# EAGLE design Lightbulb (EAGLE 9.2.0)
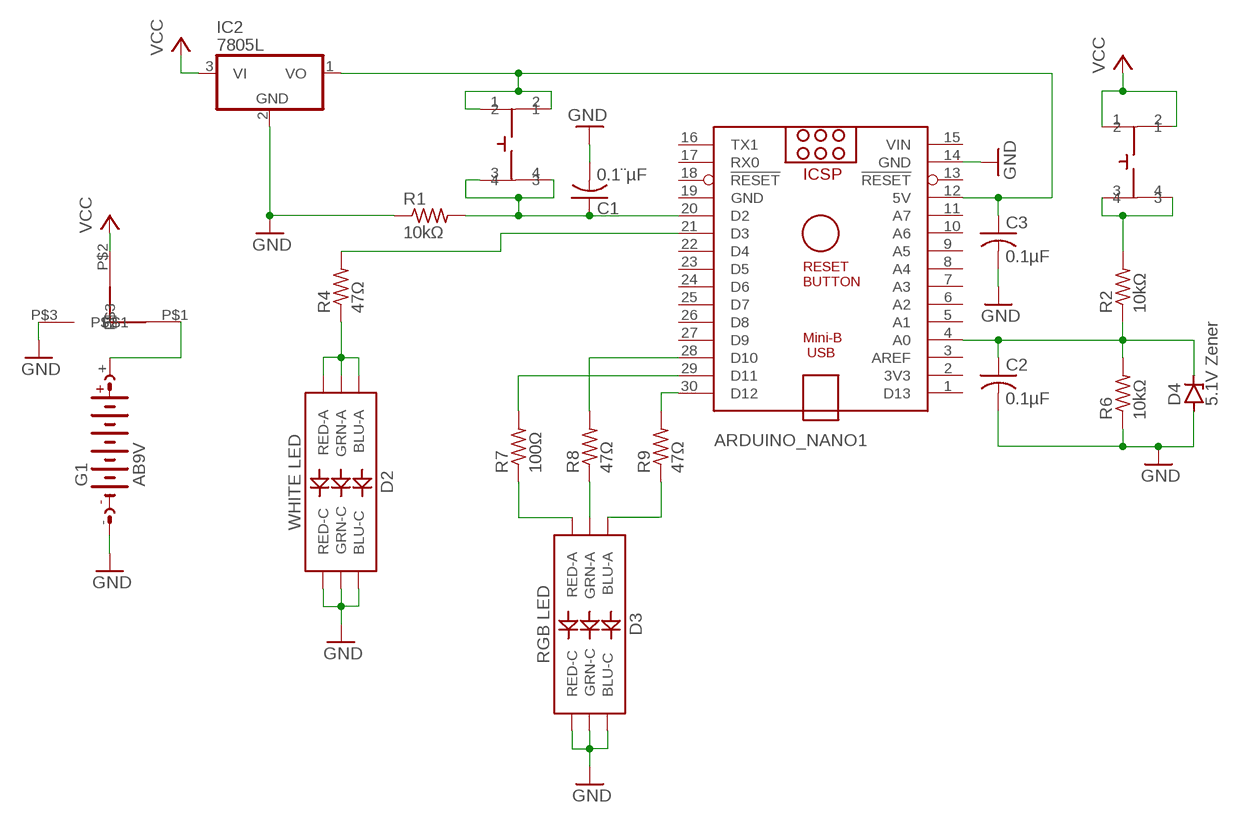
[diagram p0: schematic, sheet 1]

## Parts
ARDUINO_NANO1  ARDUINO_NANO  [ARDUINO_NANO]
C1  0.1¨µF  C-USC0805  [C0805]
C2  0.1µF  C-USC0805  [C0805]
C3  0.1µF  C-USC0805  [C0805]
D2  WHITE LED  LED-RGBNO_IC  [LED-TRICOLOR-5050]
D3  RGB LED  LED-RGBNO_IC  [LED-TRICOLOR-5050]
D4  5.1V Zener  ZENER-DIODESOD64-12  [SOD64Z12]
G1  AB9V  [AB9V]
IC2  7805L  [TO92]
R1  10kΩ  R-US_R0805  [R0805]
R2  10kΩ  R-US_R0805  [R0805]
R4  47Ω  R-US_R0805  [R0805]
R6  10kΩ  R-US_R0805  [R0805]
R7  100Ω  R-US_R0805  [R0805]
R8  47Ω  R-US_R0805  [R0805]
R9  47Ω  R-US_R0805  [R0805]
U$1  SKRPABE010  [SKRPABE010]
U$2  SKRPABE010  [SKRPABE010]
U$3  DIPSWITCH  [DIPSWITCH]

## Nets
GND: ARDUINO_NANO1.14(GND) C1.2 C2.2 C3.2 D2.4(BLU-C) D2.5(RED-C) D2.6(GRN-C) D3.4(BLU-C) D3.5(RED-C) D3.6(GRN-C) D4.A G1.- IC2.2(GND) R1.1 R6.1 U$3.P$3
N$1: G1.+ U$3.P$1
N$2: ARDUINO_NANO1.30(D12) R9.2
N$3: ARDUINO_NANO1.20(D2) C1.1 R1.2 U$1.3 U$1.4
N$4: ARDUINO_NANO1.12(5V) C3.1 IC2.1(VO) U$1.1 U$1.2
N$5: ARDUINO_NANO1.4(A0) C2.1 D4.C R2.1 R6.2
N$6: R2.2 U$2.3 U$2.4
N$7: ARDUINO_NANO1.21(D3) R4.2
N$8: ARDUINO_NANO1.29(D11) R7.2
N$9: D3.2(RED-A) R7.1
N$10: D3.1(GRN-A) R8.1
N$11: D3.3(BLU-A) R9.1
N$12: ARDUINO_NANO1.28(D10) R8.2
N$18: D2.1(GRN-A) D2.2(RED-A) D2.3(BLU-A) R4.1
VCC: IC2.3(VI) U$2.1 U$2.2 U$3.P$2
Unconnected: ARDUINO_NANO1.1(D13) ARDUINO_NANO1.2(3V3) ARDUINO_NANO1.3(AREF) ARDUINO_NANO1.5(A1) ARDUINO_NANO1.6(A2) ARDUINO_NANO1.7(A3) ARDUINO_NANO1.8(A4) ARDUINO_NANO1.9(A5) ARDUINO_NANO1.10(A6) ARDUINO_NANO1.11(A7) ARDUINO_NANO1.13(!RESET) ARDUINO_NANO1.16(TX1) ARDUINO_NANO1.17(RX0) ARDUINO_NANO1.18(!RESET) ARDUINO_NANO1.22(D4) ARDUINO_NANO1.23(D5) ARDUINO_NANO1.24(D6) ARDUINO_NANO1.25(D7) ARDUINO_NANO1.26(D8) ARDUINO_NANO1.27(D9)

## Power pins joined to a net without a drawn wire
GND: ARDUINO_NANO1.19(GND)
VIN: ARDUINO_NANO1.15(VIN)

## Library data of the parts
ARDUINO_NANO1 = ArduinoNanoV30:ARDUINO_NANO: Arduino Nano V3.0 Overview: The Arduino Nano is a small, complete, and breadboard-friendly board based on the ATmega328 (Arduino Nano 3.x) or ATmega168 (Arduino Nano 2.x). It has more or less the same functionality of the Arduino Duemilanove, but in a different package. It lacks only a DC power jack, and works with a Mini-B USB cable instead of a standard one. The Nano was designed and is being produced by Gravitech. Specifications: Microcontroller Atmel ATmega168 or ATmega328 Operating Voltage (logic level) 5 V Input Voltage (recommended) 7-12 V Input Voltage (limits) 6-20 V Digital I/O Pins 14 (of which 6 provide PWM output) Analog Input Pins 8 DC Current per I/O Pin 40 mA Flash Memory 16 KB (ATmega168) or 32 KB (ATmega328) of which 2 KB used by bootloader SRAM 1 KB (ATmega168) or 2 KB (ATmega328) EEPROM 512 bytes (ATmega168) or 1 KB (ATmega328) Clock Speed 16 MHz Dimensions 0.73" x 1.70" Length 45 mm Width 18 mm Weigth 5 g Power: The Arduino Nano can be powered via the Mini-B USB connection, 6-20V unregulated external power supply (pin 30), or 5V regulated external power supply (pin 27). The power source is automatically selected to the highest voltage source. Memory: The ATmega168 has 16 KB of flash memory for storing code (of which 2 KB is used for the bootloader); the ATmega328 has 32 KB, (also with 2 KB used for the bootloader). The ATmega168 has 1 KB of SRAM and 512 bytes of EEPROM (which can be read and written with the EEPROM library); the ATmega328 has 2 KB of SRAM and 1 KB of EEPROM. Input and Output: Each of the 14 digital pins on the Nano can be used as an input or output, using pinMode(), digitalWrite(), and digitalRead() functions. They operate at 5 volts. Each pin can provide or receive a maximum of 40 mA and has an internal pull-up resistor (disconnected by default) of 20-50 kOhms. In addition, some pins have specialized functions. Visit Arduino - ArduinoBoardNano <https://www.arduino.cc/en/Main/ArduinoBoardNano>
C1-C3 = adafruit:C-US: CAPACITOR, American symbol
D2 D3 = SparkFun-LED:LED-RGB: LED-RGB 6 pin RGB LED (no common connector) Packages: PLCC-6 LED-TRICOLOR-5050 - No built-in IC SparkFun Products: Digital Sandbox <https://www.sparkfun.com/products/12651> LED- SMD RGB <https://www.sparkfun.com/products/10866>; PROD_ID: DIO-10298
D4 = diode:ZENER-DIODE: Z-Diode
G1 = battery:AB9V: 9-V BATTERY CLIP
IC2 = adafruit:78*: Positive VOLTAGE REGULATOR Added bigger pads to the TO-92 package
R1 R2 R4 R6-R9 = adafruit:R-US_: RESISTOR, American symbol
U$1 U$2 = Custom Library:SKRPABE010
U$3 = Custom Library:DIPSWITCH

## Net classes
0 default: width 0.508 mm, drill 0.508 mm, clearance 0.305 mm

## Board
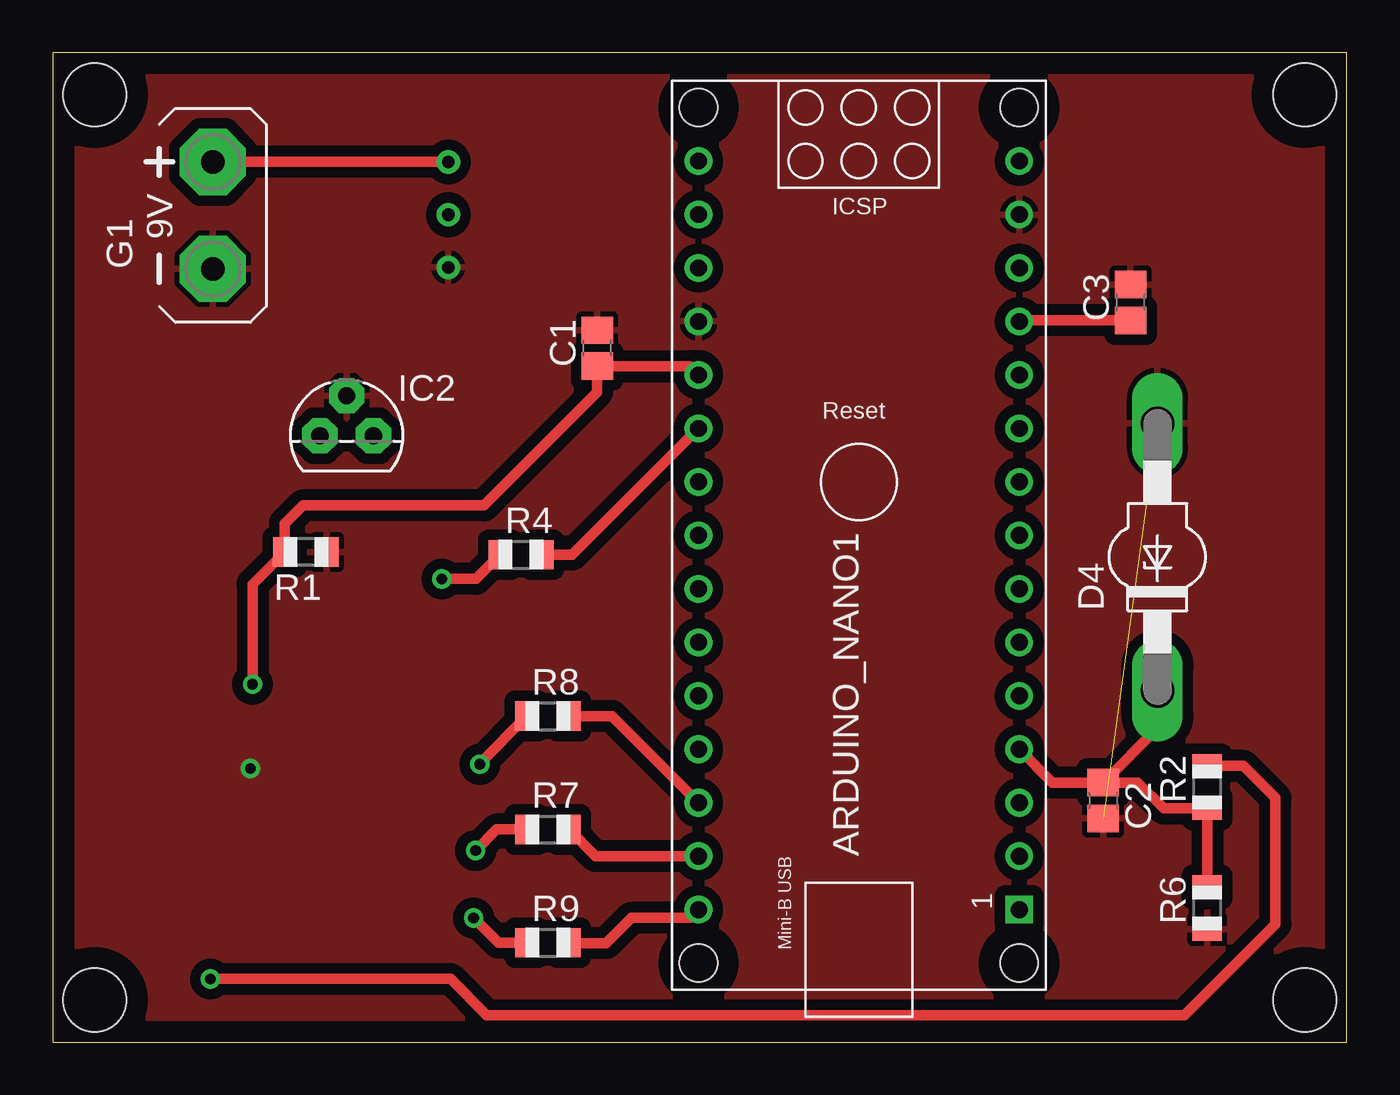
[diagram p1: board, top side]
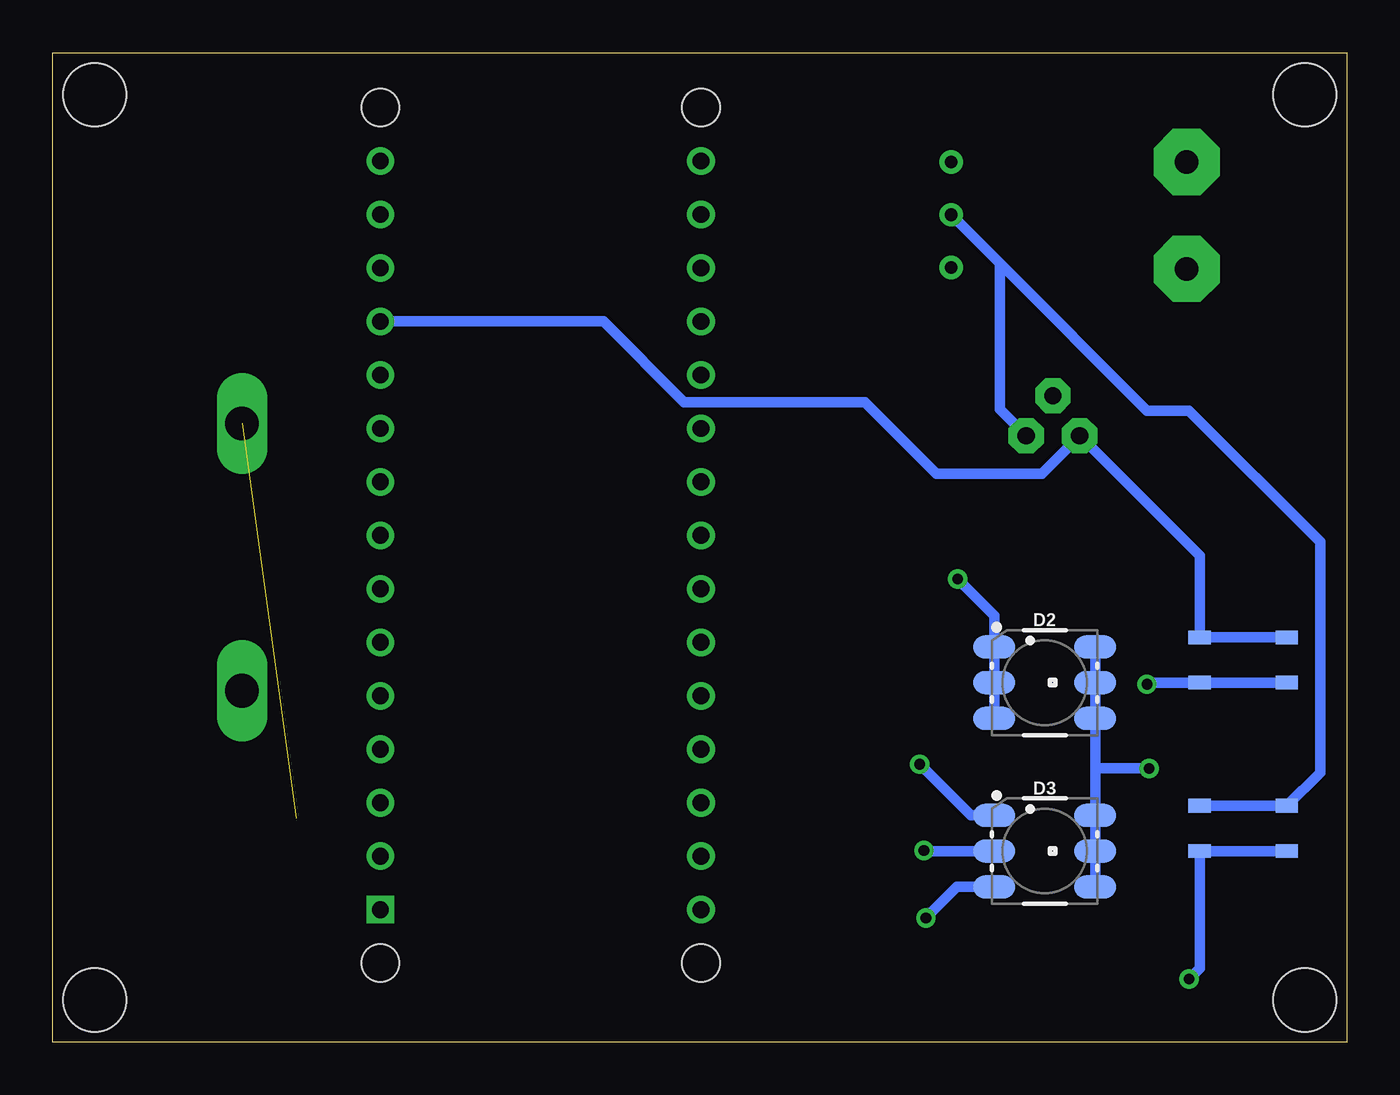
[diagram p2: board, bottom side, seen from below]

Size 61.5 x 47 mm. Coordinates in mm from the lower left corner, seen from the top.
Outline: 0,0 61.5,0 61.5,47 0,47 0,0
Copper layers (1*16): Top 0.035mm / dielectric 1.5mm / Bottom 0.035mm
Design rules "default *": minimum track width 6mil, minimum drill 0.35mm, track to track 20mil, track to pad 20mil, pad to pad 20mil, via to via 20mil, smd to smd 20mil, copper to edge 40mil, drill to drill 6mil, minimum pad ring 10mil, minimum via ring 8mil, stop-mask expansion 4mil, vias tented up to drill 0mil, thermal gap 10mil
Holes 3 mm at 2,45 2,2 59.5,2 59.5,45

### Footprints (pad centres in the part's own frame; a part is rotated, then mirrored left to right if it is on the bottom)
ARDUINO_NANO = drill 0.8 square: 1 -20.32,-7.62 | drill 0.8: 2 -17.78,-7.62; 3 -15.24,-7.62; 4 -12.7,-7.62; 5 -10.16,-7.62; 6 -7.62,-7.62; 7 -5.08,-7.62; 8 -2.54,-7.62; 9 0,-7.62; 10 2.54,-7.62; 11 5.08,-7.62; 12 7.62,-7.62; 13 10.16,-7.62; 14 12.7,-7.62; 15 15.24,-7.62; 16 15.24,7.62; 17 12.7,7.62; 18 10.16,7.62; 19 7.62,7.62; 20 5.08,7.62; 21 2.54,7.62; 22 0,7.62; 23 -2.54,7.62; 24 -5.08,7.62; 25 -7.62,7.62; 26 -10.16,7.62; 27 -12.7,7.62; 28 -15.24,7.62; 29 -17.78,7.62; 30 -20.32,7.62 | hole 1.778: -22.86,-7.62; -22.86,7.62; 17.78,7.62; 17.78,-7.62
C0805 = smd 1.3 x 1.5: 1 -0.85,0; 2 0.85,0
LED-TRICOLOR-5050 = smd 2 x 1.1: 1 -2.4,1.7; 2 -2.4,0; 3 -2.4,-1.7; 4 2.4,-1.7; 5 2.4,0; 6 2.4,1.7
SOD64Z12 = drill 1.6 long: A 6.35,0; C -6.35,0
AB9V = drill 1.118 pad 3.15 octagon: + 0,2.54; - 0,-2.54
TO92 = drill 0.813 pad 1.676 octagon: 1 -1.27,0; 2 0,1.905; 3 1.27,0
R0805 = smd 1.1 x 1.4: 1 -1,0; 2 1,0
SKRPABE010 = smd 1.05 x 0.65: 1 0,2.15; 2 4.15,2.15; 3 0,0; 4 4.15,0
DIPSWITCH = drill 0.6: P$1 0,0; P$2 0,2.5; P$3 0,5

### Placement (x,y rotation side)
ARDUINO_NANO1  38.31,26.61 90 top
C1  25.88,32.96 90 top
C2  49.92,11.48 270 top
C3  51.22,35.13 90 top
D2  14.36,17.07 0 bottom
D3  14.36,9.07 0 bottom
D4  52.5,23.04 90 top
G1  7.61,39.27 0 top
IC2  13.97,28.8 0 top
R1  12.03,23.28 180 top
R2  54.87,12.12 90 top
R4  22.26,23.15 0 top
R6  54.87,6.37 90 top
R7  23.53,10.1 0 top
R8  23.53,15.48 0 top
R9  23.53,4.72 0 top
U$1  7,17.07 0 bottom
U$2  7,9.07 0 bottom
U$3  18.8,41.8 180 top

### Tracks (layer width: path | path; a pad name or v marks a point on that pad's centre or on a via)
GND  (via drill 0.51)  (1 unrouted)
  Bottom 0.508: D2.6 D2.5 D2.4 11.96,13 | D3.4 D3.5 D3.6 11.96,13 | 11.96,13 v9.4,13
  pour Top: -0.5,48 -0.5,-1 68.5,-1 68.5,48
N$1
  Top 0.508: G1.+ U$3.P$1
N$2
  Top 0.508: ARDUINO_NANO1.30 30.31,5.91 29.8,5.91 29.79,5.9 27.5,5.9 26.3,4.7 24.55,4.7 R9.2
N$3  (via drill 0.51)
  Top 0.508: v9.5,17 9.5,21.75 R1.2 11.03,24.63 11.9,25.5 20.5,25.5 25.88,30.88 C1.1 30.27,32.11 ARDUINO_NANO1.20
  Bottom 0.508: U$1.4 U$1.3 9.43,17.07 v9.5,17
N$4
  Top 0.508: C3.1 45.98,34.28 ARDUINO_NANO1.12
  Bottom 0.508: ARDUINO_NANO1.12 35.33,34.23 31.5,30.4 22.9,30.4 19.5,27 14.5,27 IC2.1 7,23.1 U$1.1 U$1.2
N$5
  Top 0.508: R6.2 R2.1 54.84,11.1 52.8,11.1 51.57,12.33 C2.1 | D4.C 52.5,14.91 C2.1 | C2.1 47.51,12.33 ARDUINO_NANO1.4
N$6  (via drill 0.51)
  Top 0.508: v7.5,3 18.9,3 20.63,1.27 53.77,1.27 58.1,5.6 58.1,11.6 56.58,13.12 R2.2
  Bottom 0.508: U$2.4 U$2.3 7,3.5 v7.5,3
N$7
  Top 0.508: ARDUINO_NANO1.21 24.69,23.15 R4.2
N$8
  Top 0.508: ARDUINO_NANO1.29 25.8,8.83 R7.2
N$9  (via drill 0.51)
  Top 0.508: R7.1 21.1,10.1 v20.1,9.1
  Bottom 0.508: v20.1,9.1 20.07,9.07 D3.2
N$10  (via drill 0.51)
  Top 0.508: R8.1 20.3,13.25 v20.3,13.2
  Bottom 0.508: v20.3,13.2 17.88,10.78 D3.1
N$11  (via drill 0.51)
  Top 0.508: R9.1 21.18,4.72 v20,5.9
  Bottom 0.508: v20,5.9 18.52,7.38 D3.3
N$12
  Top 0.508: ARDUINO_NANO1.28 26.58,15.48 R8.2
N$18  (via drill 0.51)
  Top 0.508: R4.1 20.11,22 v18.5,22
  Bottom 0.508: v18.5,22 16.76,20.26 D2.1 D2.2 D2.3
VCC
  Bottom 0.508: U$3.P$2 16.5,37 | 16.5,37 9.5,30 7.5,30 1.27,23.77 1.27,12.8 U$2.2 U$2.1 | IC2.3 16.5,30.06 16.5,37